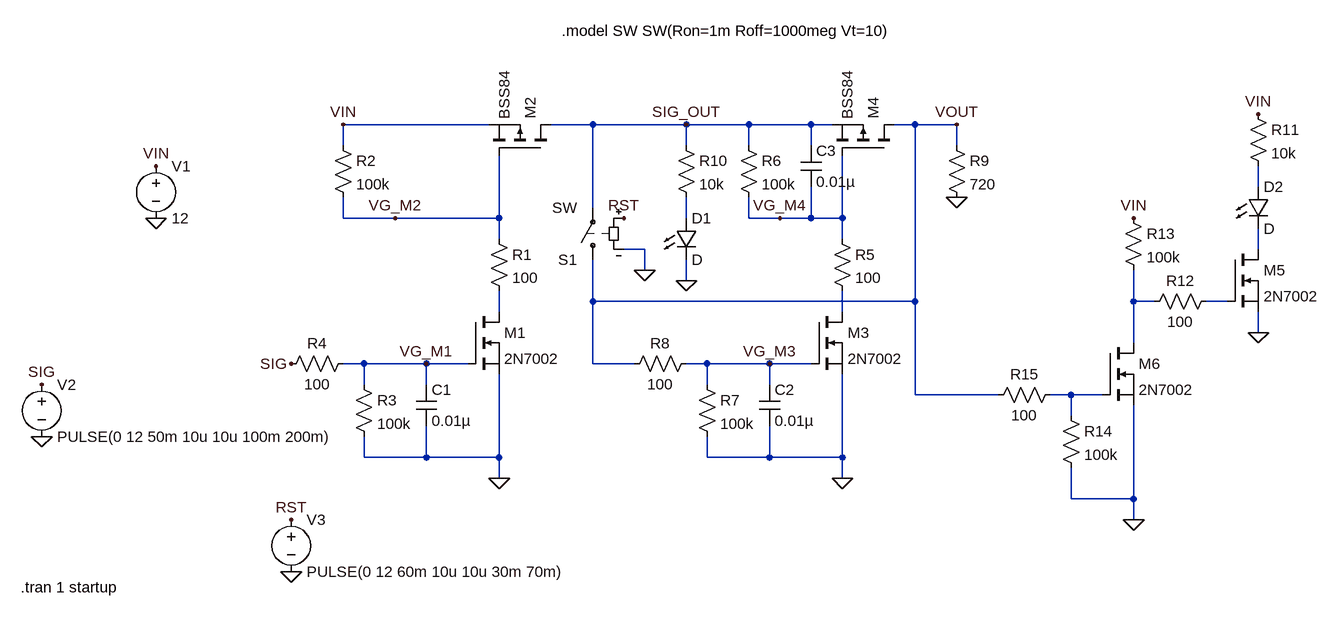
[diagram p0: schematic Latch-Circuit.asc]
Latch-Circuit.asc, the LTspice schematic file:
Version 4
SHEET 1 1416 680
WIRE 128 -64 -96 -64
WIRE 288 -64 224 -64
WIRE 432 -64 288 -64
WIRE 528 -64 432 -64
WIRE 624 -64 528 -64
WIRE 656 -64 624 -64
WIRE 784 -64 752 -64
WIRE 848 -64 784 -64
WIRE -96 -32 -96 -64
WIRE 432 -32 432 -64
WIRE 528 -32 528 -64
WIRE 624 -32 624 -64
WIRE 848 -32 848 -64
WIRE 1312 32 1312 0
WIRE 288 64 288 -64
WIRE -96 80 -96 48
WIRE -16 80 -96 80
WIRE 144 80 144 -16
WIRE 144 80 -16 80
WIRE 432 80 432 48
WIRE 528 80 528 48
WIRE 576 80 528 80
WIRE 624 80 624 32
WIRE 624 80 576 80
WIRE 672 80 672 -16
WIRE 672 80 624 80
WIRE 144 112 144 80
WIRE 672 112 672 80
WIRE 368 128 336 128
WIRE 1312 128 1312 96
WIRE 368 160 368 128
WIRE 432 176 432 144
WIRE 288 208 288 144
WIRE 784 208 784 -64
WIRE 784 208 288 208
WIRE 1120 208 1120 160
WIRE 1152 208 1120 208
WIRE 1264 208 1232 208
WIRE 144 224 144 192
WIRE 672 224 672 192
WIRE 1312 256 1312 224
WIRE 1120 272 1120 208
WIRE -64 304 -96 304
WIRE 32 304 -64 304
WIRE 96 304 32 304
WIRE 288 304 288 208
WIRE 352 304 288 304
WIRE 464 304 432 304
WIRE 560 304 464 304
WIRE 624 304 560 304
WIRE -64 336 -64 304
WIRE 32 336 32 304
WIRE 464 336 464 304
WIRE 560 336 560 304
WIRE 784 352 784 208
WIRE 912 352 784 352
WIRE 1024 352 992 352
WIRE 1072 352 1024 352
WIRE 1024 384 1024 352
WIRE -64 448 -64 416
WIRE 32 448 32 400
WIRE 32 448 -64 448
WIRE 144 448 144 320
WIRE 144 448 32 448
WIRE 464 448 464 416
WIRE 560 448 560 400
WIRE 560 448 464 448
WIRE 672 448 672 320
WIRE 672 448 560 448
WIRE 144 480 144 448
WIRE 672 480 672 448
WIRE 1024 512 1024 464
WIRE 1120 512 1120 368
WIRE 1120 512 1024 512
WIRE 1120 544 1120 512
FLAG -384 0 VIN
FLAG -96 -64 VIN
FLAG -560 336 SIG
FLAG -176 304 SIG
FLAG -384 80 0
FLAG -560 416 0
FLAG 144 480 0
FLAG 672 480 0
FLAG 848 48 0
FLAG 848 -64 VOUT
FLAG 336 80 RST
FLAG -176 544 RST
FLAG -176 624 0
FLAG 368 160 0
FLAG 576 80 VG_M4
FLAG -16 80 VG_M2
FLAG 560 304 VG_M3
FLAG 32 304 VG_M1
FLAG 432 -64 SIG_OUT
FLAG 432 176 0
FLAG 1312 256 0
FLAG 1312 -80 VIN
FLAG 1120 80 VIN
FLAG 1120 544 0
SYMBOL nmos 96 224 R0
SYMATTR InstName M1
SYMATTR Value 2N7002
SYMBOL pmos 224 -16 M270
SYMATTR InstName M2
SYMATTR Value BSS84
SYMBOL res 128 96 R0
SYMATTR InstName R1
SYMATTR Value 100
SYMBOL res -112 -48 R0
SYMATTR InstName R2
SYMATTR Value 100k
SYMBOL res -80 320 R0
SYMATTR InstName R3
SYMATTR Value 100k
SYMBOL res -80 288 R90
WINDOW 0 0 56 VBottom 2
WINDOW 3 32 56 VTop 2
SYMATTR InstName R4
SYMATTR Value 100
SYMBOL cap 16 336 R0
SYMATTR InstName C1
SYMATTR Value 0.01µ
SYMBOL voltage -384 -16 R0
WINDOW 123 0 0 Left 0
WINDOW 39 0 0 Left 0
SYMATTR InstName V1
SYMATTR Value 12
SYMBOL voltage -560 320 R0
WINDOW 123 0 0 Left 0
WINDOW 39 0 0 Left 0
SYMATTR InstName V2
SYMATTR Value PULSE(0 12 50m 10u 10u 100m 200m)
SYMBOL nmos 624 224 R0
SYMATTR InstName M3
SYMATTR Value 2N7002
SYMBOL pmos 752 -16 M270
SYMATTR InstName M4
SYMATTR Value BSS84
SYMBOL res 656 96 R0
SYMATTR InstName R5
SYMATTR Value 100
SYMBOL res 512 -48 R0
SYMATTR InstName R6
SYMATTR Value 100k
SYMBOL res 448 320 R0
SYMATTR InstName R7
SYMATTR Value 100k
SYMBOL res 448 288 R90
WINDOW 0 0 56 VBottom 2
WINDOW 3 32 56 VTop 2
SYMATTR InstName R8
SYMATTR Value 100
SYMBOL cap 544 336 R0
SYMATTR InstName C2
SYMATTR Value 0.01µ
SYMBOL res 832 -48 R0
SYMATTR InstName R9
SYMATTR Value 720
SYMBOL sw 288 160 R180
SYMATTR InstName S1
SYMBOL voltage -176 528 R0
WINDOW 123 0 0 Left 0
WINDOW 39 0 0 Left 0
SYMATTR InstName V3
SYMATTR Value PULSE(0 12 60m 10u 10u 30m 70m)
SYMBOL res 416 -48 R0
SYMATTR InstName R10
SYMATTR Value 10k
SYMBOL cap 608 -32 R0
SYMATTR InstName C3
SYMATTR Value 0.01µ
SYMBOL LED 416 80 R0
SYMATTR InstName D1
SYMBOL nmos 1264 128 R0
SYMATTR InstName M5
SYMATTR Value 2N7002
SYMBOL LED 1296 32 R0
SYMATTR InstName D2
SYMBOL res 1296 -96 R0
SYMATTR InstName R11
SYMATTR Value 10k
SYMBOL nmos 1072 272 R0
SYMATTR InstName M6
SYMATTR Value 2N7002
SYMBOL res 1248 192 R90
WINDOW 0 0 56 VBottom 2
WINDOW 3 32 56 VTop 2
SYMATTR InstName R12
SYMATTR Value 100
SYMBOL res 1104 64 R0
SYMATTR InstName R13
SYMATTR Value 100k
SYMBOL res 1008 368 R0
SYMATTR InstName R14
SYMATTR Value 100k
SYMBOL res 1008 336 R90
WINDOW 0 0 56 VBottom 2
WINDOW 3 32 56 VTop 2
SYMATTR InstName R15
SYMATTR Value 100
TEXT 240 -208 Left 2 !.model SW SW(Ron=1m Roff=1000meg Vt=10)
TEXT -592 648 Left 2 !.tran 1 startup

The netlist it stands for:
* Latch-Circuit.asc
M1 N006 VG_M1 0 0 2N7002
M2 SIG_OUT VG_M2 VIN VIN BSS84
R1 VG_M2 N006 100
R2 VIN VG_M2 100k
R3 VG_M1 0 100k
R4 VG_M1 SIG 100
C1 VG_M1 0 0.01µ
V1 VIN 0 12
V2 SIG 0 PULSE(0 12 50m 10u 10u 100m 200m)
M3 N007 VG_M3 0 0 2N7002
M4 VOUT VG_M4 SIG_OUT SIG_OUT BSS84
R5 VG_M4 N007 100
R6 SIG_OUT VG_M4 100k
R7 VG_M3 0 100k
R8 VG_M3 VOUT 100
C2 VG_M3 0 0.01µ
R9 VOUT 0 720
S1 VOUT SIG_OUT RST 0 SW
V3 RST 0 PULSE(0 12 60m 10u 10u 30m 70m)
R10 SIG_OUT N002 10k
C3 SIG_OUT VG_M4 0.01µ
D1 N002 0 D
M5 N003 N005 0 0 2N7002
D2 N001 N003 D
R11 VIN N001 10k
M6 N004 N008 0 0 2N7002
R12 N005 N004 100
R13 VIN N004 100k
R14 N008 0 100k
R15 N008 VOUT 100
.model D D
.lib standard.dio
.model NMOS NMOS
.model PMOS PMOS
.lib standard.mos
.model SW SW(Ron=1m Roff=1000meg Vt=10)
.tran 1 startup
.backanno
.end